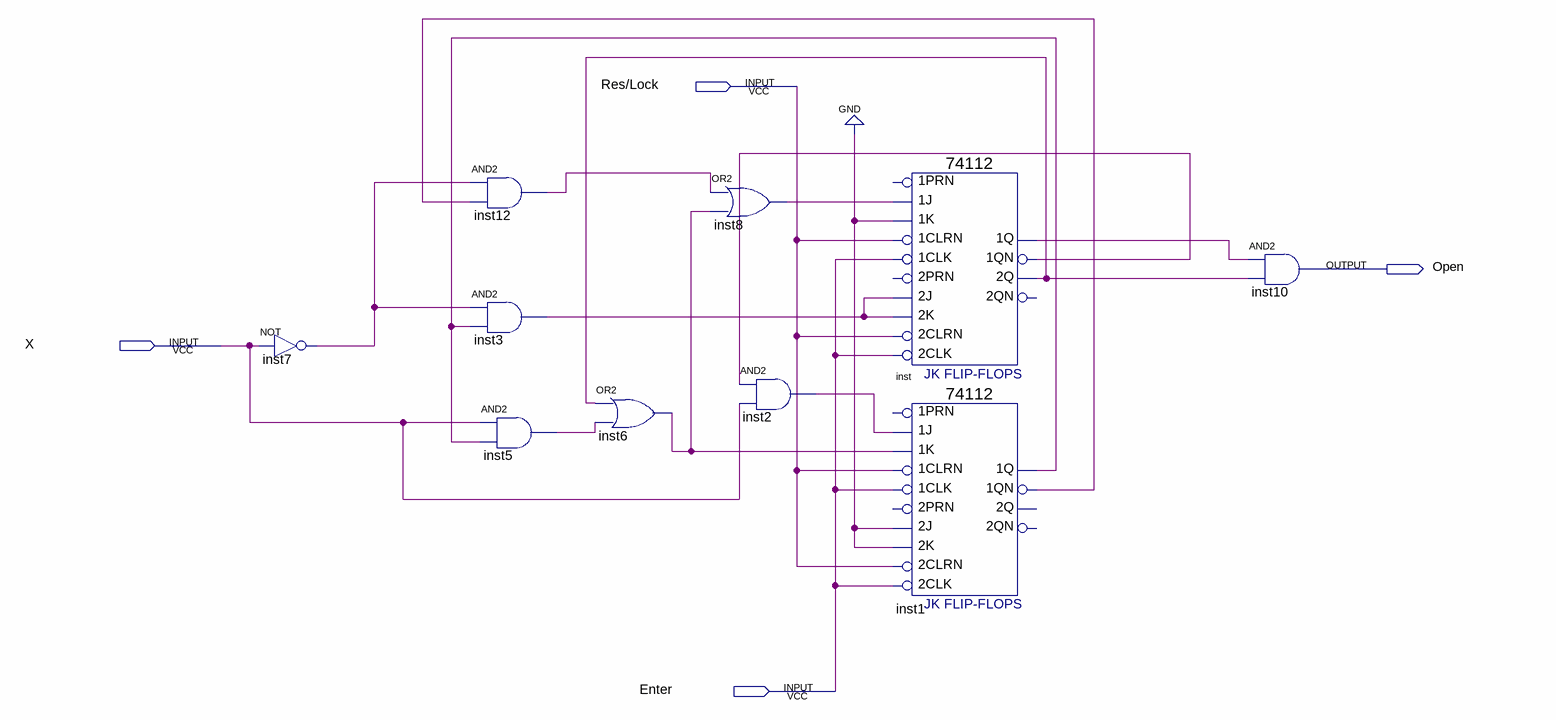
[diagram p0: schematic sheet]
// Quartus schematic DigLockContr.bdf as structural Verilog: 10 symbols, 4 pins
module DigLockContr (
  input  \Res/Lock ,
  input  X,
  input  Enter,
  output Open
);

  wire inst1_1q, inst1_1qn, inst2_out, inst3_out, inst5_out, inst6_out, inst7_out, inst8_out, inst12_out,
       inst_1q, inst_1qn, inst_2q;

  not inst7 (inst7_out, X);
  and inst12 (inst12_out, inst7_out, inst1_1qn);
  and inst3 (inst3_out, inst7_out, inst1_1q);
  and inst5 (inst5_out, X, inst1_1q);
  or inst6 (inst6_out, inst_2q, inst5_out);
  or inst8 (inst8_out, inst12_out, inst6_out);
  and inst2 (inst2_out, inst_1qn, X);
  \74112  inst (
    .\1K (1'b0), .\1J (inst8_out), .\1CLK (Enter), .\1CLRN (\Res/Lock ), .\2K (inst3_out), .\2J (inst3_out),
    .\2CLK (Enter), .\2CLRN (\Res/Lock ), .\1QN (inst_1qn), .\2Q (inst_2q), .\1Q (inst_1q));  // open: 1PRN, 2PRN, 2QN
  \74112  inst1 (
    .\1K (inst6_out), .\1J (inst2_out), .\1CLK (Enter), .\1CLRN (\Res/Lock ), .\2K (1'b0), .\2J (1'b0),
    .\2CLK (Enter), .\2CLRN (\Res/Lock ), .\1QN (inst1_1qn), .\1Q (inst1_1q));  // open: 1PRN, 2PRN, 2Q, 2QN
  and inst10 (Open, inst_1q, inst_2q);
endmodule
